# EAGLE design SipPuffDuoOutputsATtiny84MOSFET (EAGLE 9.1.3)
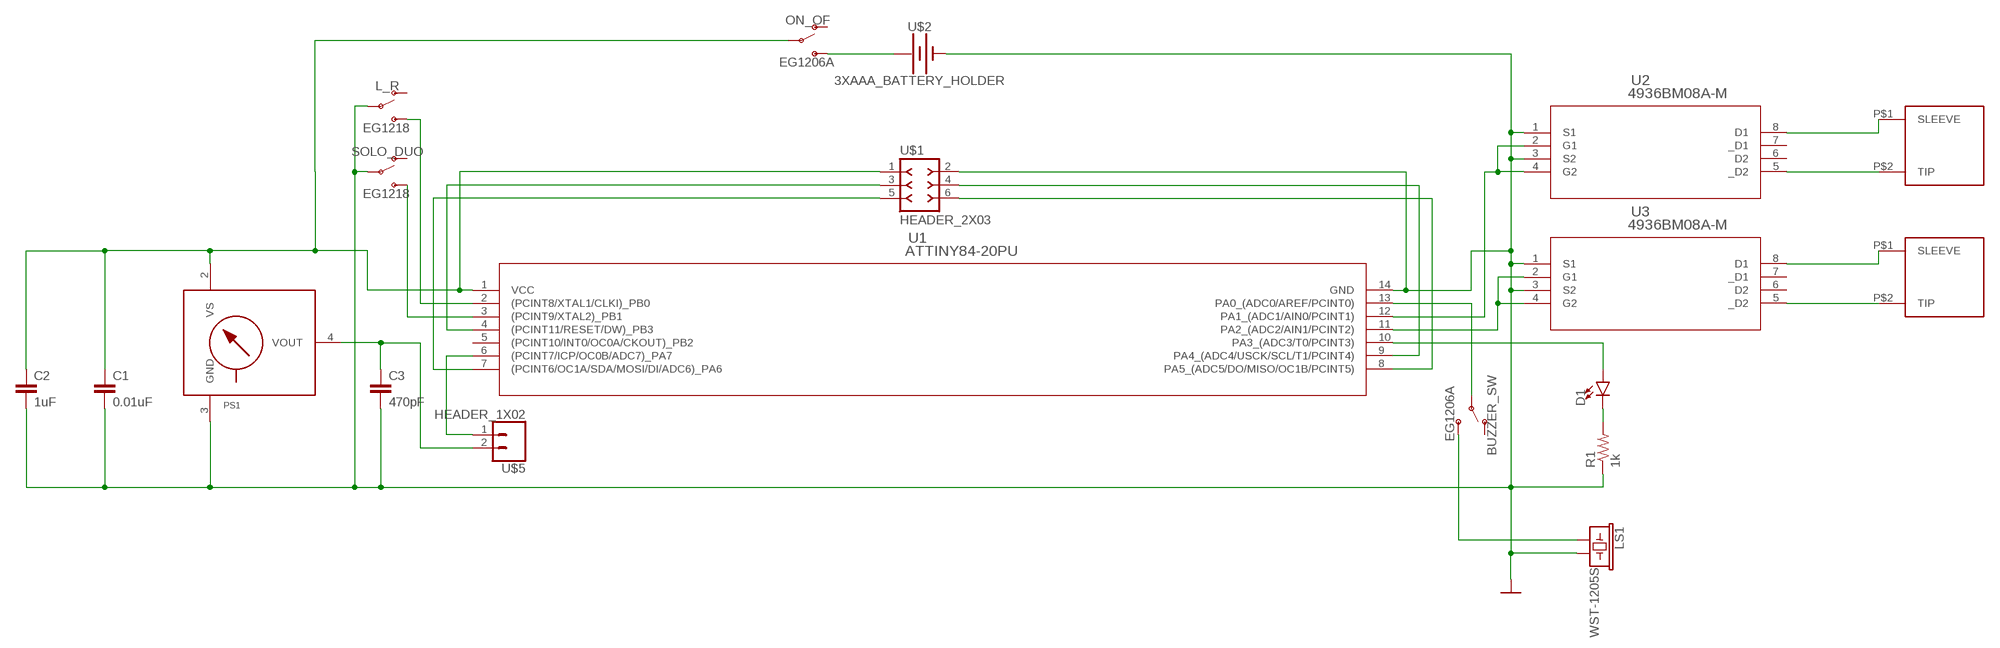
[diagram p0: schematic, sheet 1]

## Parts
BUZZER_SW  EG1206A  [EG1206A]
C1  0.01uF  0.1UF-KIT-EZ-50V-20%  [CAP-PTH-SMALL-KIT]
C2  1uF  0.1UF-KIT-EZ-50V-20%  [CAP-PTH-SMALL-KIT]
C3  470pF  0.1UF-KIT-EZ-50V-20%  [CAP-PTH-SMALL-KIT]
D1  LED5MM  [LED_5MM]
L_R  EG1218  [EG1218]
LS1  WST-1205S  BUZZER-PTH  [BUZZER-12MM]
ON_OF  EG1206A  [EG1206A]
PS1  MPX-1351  [1351]
R1  1k  RESISTOR_R-US_  [RESISTOR_0207/10]
SOLO_DUO  EG1218  [EG1218]
U1  ATTINY84-20PU  [14P3]
U2  4936BM08A-M  [M08A-M]
U3  4936BM08A-M  [M08A-M]
U$1  HEADER_2X03  [2X3]
U$2  3XAAA_BATTERY_HOLDER  [3XAAA_BATTERY_HOLDER]
U$3  MONO_WIRE  [MONO_WIRE]
U$4  MONO_WIRE  [MONO_WIRE]
U$5  HEADER_1X02  [1X02]

## Nets
5V: C1.1 C2.1 ON_OF.2(P) PS1.2(VS) U1.1(VCC) U$1.1
GND: C1.2 C2.2 C3.2 L_R.2(P) LS1.- PS1.3(GND) R1.1 SOLO_DUO.2(P) U1.14(GND) U2.1(S1) U2.3(S2) U3.1(S1) U3.3(S2) U$1.2 U$2.P$2(-)
MPXVOUT: C3.1 PS1.4(VOUT) U$5.2
N$1: D1.A U1.10(PA3_(ADC3/T0/PCINT3))
N$2: U1.12(PA1_(ADC1/AIN0/PCINT1)) U2.2(G1) U2.4(G2)
N$3: L_R.3(S) U1.2((PCINT8/XTAL1/CLKI)_PB0)
N$4: U1.11(PA2_(ADC2/AIN1/PCINT2)) U3.2(G1) U3.4(G2)
N$5: SOLO_DUO.3(S) U1.3((PCINT9/XTAL2)_PB1)
N$6: U1.8(PA5_(ADC5/DO/MISO/OC1B/PCINT5)) U$1.6
N$7: D1.K(C) R1.2
N$8: U1.4((PCINT11/RESET/DW)_PB3) U$1.3
N$9: U1.9(PA4_(ADC4/USCK/SCL/T1/PCINT4)) U$1.4
N$10: U1.7((PCINT6/OC1A/SDA/MOSI/DI/ADC6)_PA6) U$1.5
N$11: ON_OF.3(S) U$2.P$1(+)
N$12: BUZZER_SW.3(S) LS1.+
N$13: BUZZER_SW.2(P) U1.13(PA0_(ADC0/AREF/PCINT0))
N$14: U2.8(D1) U$3.P$1(SLEEVE)
N$15: U2.5(_D2) U$3.P$2(TIP)
N$16: U3.5(_D2) U$4.P$2(TIP)
N$17: U3.8(D1) U$4.P$1(SLEEVE)
N$18: U1.6((PCINT7/ICP/OC0B/ADC7)_PA7) U$5.1
Unconnected: BUZZER_SW.1(O) L_R.1(O) ON_OF.1(O) PS1.1(NC) PS1.5(NC) PS1.6(NC) SOLO_DUO.1(O) U1.5((PCINT10/INT0/OC0A/CKOUT)_PB2) U2.6(D2) U2.7(_D1) U3.6(D2) U3.7(_D1)

## Library data of the parts
BUZZER_SW ON_OF = MMC Eagle:EG1206A
C1-C3 = MMC Eagle:0.1UF: 0.1µF ceramic capacitors A capacitor is a passive two-terminal electrical component used to store electrical energy temporarily in an electric field.; PROD_ID: CAP-08370; VALUE: 0.1uF
D1 = MMC Eagle:LED: LED (Generic) Standard schematic elements and footprints for 5mm, 3mm, 1206, and 0603 sized LEDs. Generic LEDs with no color specified.
L_R SOLO_DUO = MMC Eagle:EG1218
LS1 = MMC Eagle:BUZZER: Buzzer Small round buzzers that operate around the audible 2kHz range. You can use these as speakers to create simple music or user interfaces. Variant Overview: PTH - Mini Speaker - PC Mount 12mm 2.048kHz <https://www.sparkfun.com/products/7950> PTH_KIT - Mini Speaker - PC Mount 12mm 2.048kHz <https://www.sparkfun.com/products/7950> KIT simplifies soldering by adding stop mask to one side of the pads. PTH_NO_SILK - Mini Speaker - PC Mount 12mm 2.048kHz <https://www.sparkfun.com/products/7950> No silkscreen indicator of buzzer outline. PTH_KIT_NO_SILK - Mini Speaker - PC Mount 12mm 2.048kHz <https://www.sparkfun.com/products/7950> KIT package w/o silkscreen SMD - Buzzer Audio Magnetic (CCV-084B16) SMD buzzer used on, e.g. the LilyPad Buzzer <https://www.sparkfun.com/products/8463> and RFID USB Reader <https://www.sparkfun.com/products/9963>. SMD_KIT - Buzzer Audio Magnetic (CCV-084B16) SMD Buzzer with elongated pins to make soldering easier. Used on the SparkFun Simon Says - Surface Mount Soldering Kit <https://www.sparkfun.com/products/10935>.; PROD_ID: COMP-08253; SF_SKU: COM-07950
PS1 = MMC Eagle:MPX*****: Generic MPX pressure sensor
R1 = MMC Eagle:RESISTOR_R-US_: RESISTOR, American symbol
U1 = MMC Eagle:ATTINY84-20PU; MANUFACTURER_PART_NUMBER: ATTINY8420PU; VENDOR: Atmel
U2 U3 = MMC Eagle:4936B; MANUFACTURER_PART_NUMBER: LM34DM; VENDOR: Texas Instruments
U$1 = MMC Eagle:HEADER_2X03
U$2 = MMC Eagle:3XAAA_BATTERY_HOLDER
U$3 U$4 = MMC Eagle:MONO_WIRE
U$5 = MMC Eagle:HEADER_1X02

## Board
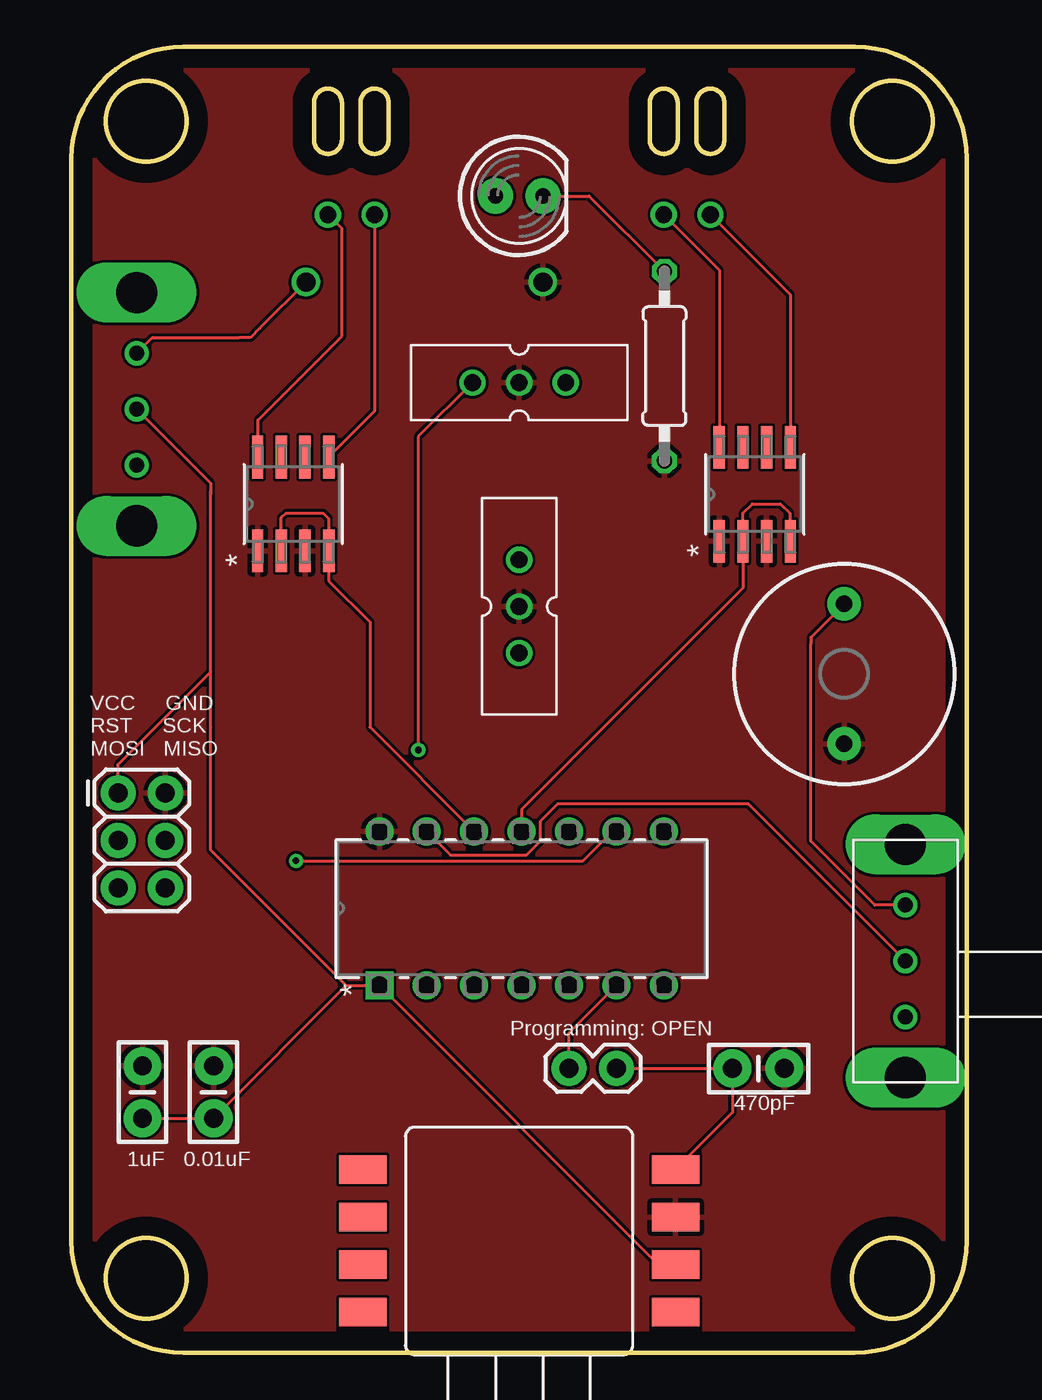
[diagram p1: board, top side]
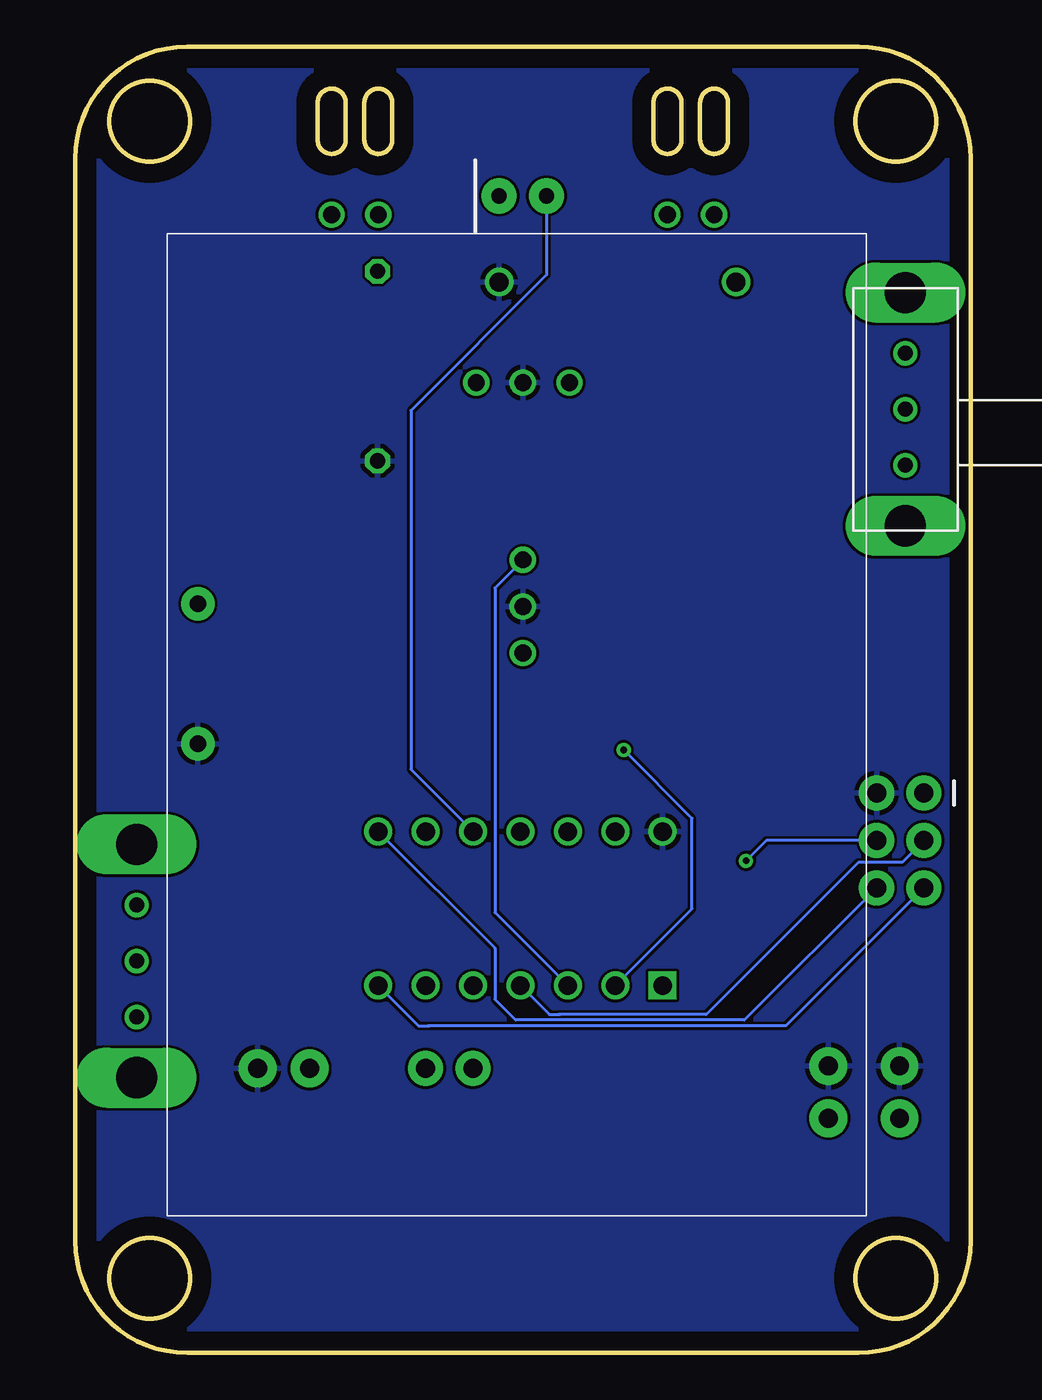
[diagram p2: board, bottom side, seen from below]

Size 48 x 70 mm. Coordinates in mm from the lower left corner, seen from the top.
Outline: 35,67 arc180 33.5,67
Outline: 33.5,67 33.5,65
Outline: 33.5,65 arc180 35,65
Outline: 35,65 35,67
Outline: 31,65 arc180 32.5,65
Outline: 31,67 31,65
Outline: 32.5,67 arc180 31,67
Outline: 32.5,65 32.5,67
Outline: 17,67 arc180 15.5,67
Outline: 15.5,67 15.5,65
Outline: 15.5,65 arc180 17,65
Outline: 17,65 17,67
Outline: 13,65 arc180 14.5,65
Outline: 13,67 13,65
Outline: 14.5,67 arc180 13,67
Outline: 14.5,65 14.5,67
Outline: 13,65 13,67
Outline: 13,67 arc-180 14.5,67
Outline: 14.5,67 14.5,65
Outline: 14.5,65 arc-180 13,65
Outline: 15.5,67 15.5,65
Outline: 15.5,65 arc180 17,65
Outline: 17,65 17,67
Outline: 17,67 arc180 15.5,67
Outline: 31,65 31,67
Outline: 31,67 arc-180 32.5,67
Outline: 32.5,67 32.5,65
Outline: 32.5,65 arc-180 31,65
Outline: 33.5,67 33.5,65
Outline: 33.5,65 arc180 35,65
Outline: 35,65 35,67
Outline: 35,67 arc180 33.5,67
Outline: 42,70 6,70 arc90 0,64 0,6 arc90 6,0 42,0 arc90 48,6 48,64 arc90 42,70
Outline: circle at 4,66 radius 2.15
Outline: circle at 44,66 radius 2.15
Outline: circle at 4,4 radius 2.15
Outline: circle at 44,4 radius 2.15
Copper layers (1*16): Top 0.035mm / dielectric 1.5mm / Bottom 0.035mm
Design rules "default": minimum track width 6mil, minimum drill 0.35mm, track to track 6mil, track to pad 6mil, pad to pad 6mil, via to via 6mil, smd to smd 6mil, copper to edge 40mil, drill to drill 6mil, minimum pad ring 10mil, minimum via ring 8mil, stop-mask expansion 4mil, vias tented up to drill 0mil, thermal gap 10mil

### Footprints (pad centres in the part's own frame; a part is rotated, then mirrored left to right if it is on the bottom)
EG1206A = drill 0.8: 1 3.5,2.8; 2 6.5,2.8; 3 9.5,2.8 | drill 2.2 pad 2.54 long: MT1 0.25,2.8; MT2 12.75,2.8
CAP-PTH-SMALL-KIT = drill 1.016 pad 2.032: 1 -1.397,0; 2 1.397,0
LED_5MM = drill 0.813 pad 1.88: A -1.27,0; K 1.27,0
EG1218 = drill 0.9: 1 -2.5,0; 2 0,0; 3 2.5,0
BUZZER-12MM = drill 0.9 pad 1.778: + 3.75,0; - -3.75,0
1351 = smd 2.54 x 1.524: 1 8.382,-3.81; 2 8.382,-1.27; 3 8.382,1.27; 4 8.382,3.81; 5 -8.382,3.81; 6 -8.382,1.27; 7 -8.382,-1.27; 8 -8.382,-3.81
RESISTOR_0207/10 = drill 0.813 octagon: 1 -5.08,0; 2 5.08,0
14P3 = drill 0.991 pad 1.499 square: 1 -8.255,15.24 | drill 0.991 pad 1.499: 2 -8.255,12.7; 3 -8.255,10.16; 4 -8.255,7.62; 5 -8.255,5.08; 6 -8.255,2.54; 7 -8.255,0; 8 0,0; 9 0,2.54; 10 0,5.08; 11 0,7.62; 12 0,10.16; 13 0,12.7; 14 0,15.24
M08A-M = smd 2.286 x 0.61: 1 -2.515,1.905; 2 -2.515,0.635; 3 -2.515,-0.635; 4 -2.515,-1.905; 5 2.515,-1.905; 6 2.515,-0.635; 7 2.515,0.635; 8 2.515,1.905
2X3 = drill 1.016 pad 1.88: 1 0,0; 2 0,2.54; 3 2.54,0; 4 2.54,2.54; 5 5.08,0; 6 5.08,2.54
3XAAA_BATTERY_HOLDER = drill 1.02: P$1 50.035,6.995; P$2 50.035,19.695
MONO_WIRE = drill 0.9: P$1 -1.25,0; P$2 1.25,0
1X02 = drill 1.016 pad 1.88: 1 0,0; 2 2.54,0

### Placement (x,y rotation side)
BUZZER_SW  47.5,14.5 90 top
C1  7.62,13.97 90 top
C2  3.81,13.97 90 top
C3  36.83,15.24 0 top
D1  24,62 0 top
L_R  24,52 180 top
LS1  41.42,36.39 90 top
ON_OF  0.7,44.07 90 bottom
PS1  24,6 0 top
R1  31.79,52.88 90 top
SOLO_DUO  24,40 90 top
U1  31.75,27.94 90 top
U2  11.89,45.49 90 top
U3  36.63,46.01 90 top
U$1  2.5,30 270 top
U$2  5.58,7.35 90 bottom
U$3  15,61 0 top
U$4  33,61 0 top
U$5  26.68,15.25 0 top

### Tracks (layer width: path | path; a pad name or v marks a point on that pad's centre or on a via)
5V
  Top 0.152: 7.47,35 7.47,33.53 7.47,26.95 14.73,19.68 | 7.47,35 7.47,36.5 | 7.47,36.5 7.47,46 | 7.47,46 7.47,46.18 | ON_OF.2 7.47,46.6 7.47,46 | C2.1 C1.1 14.73,19.68 | 14.73,19.68 U1.1 31.46,4.73 PS1.2 | 7.47,34.97 7.47,35 | U$1.1 2.5,31.53 7.47,36.5
GND
  pour Bottom: -1.17,70.93 49.85,70.93 49.85,-1.12 -1.17,-1.12
  pour Top: -1.25,71.16 48.82,71.16 48.82,-1.04 -1.25,-1.04
MPXVOUT
  Top 0.152: PS1.4 32.46,9.91 35.43,12.88 C3.1 U$5.2
N$1
  Bottom 0.152: D1.A 22.73,57.77 30,50.5 30,31.27 U1.10
N$2
  Top 0.152: U1.12 16,33.53 16,39.17 13.79,41.37 U2.4 13.79,44.7 13.5,45 11.5,45 11.26,44.76 U2.2
N$3  (via drill 0.35)
  Top 0.152: L_R.3 18.59,49.09 v18.59,32.31
  Bottom 0.152: v18.59,32.31 14.94,28.65 14.94,23.8 U1.2
N$4
  Top 0.152: 35.97,43.43 U3.2 | 38.56,43.43 U3.4 | U3.4 38.53,43 38.53,42.65 | U3.2 36,45 36.5,45.5 38,45.5 38.5,45 38.5,43.53 U3.4 | U3.2 35.99,40.99 24.13,29.13 U1.11
N$5
  Bottom 0.152: SOLO_DUO.3 25.5,41 25.5,23.59 U1.3
N$6
  Bottom 0.152: U1.8 25.5,21.69 25.5,18.95 24.38,17.83 12.13,17.83 U$1.6
N$7
  Top 0.152: D1.K 27.75,62 R1.2
N$8
  Bottom 0.152: 22,18.14 14.17,18.14 6.02,26.29 3.67,26.29 U$1.3 | 22,18.14 22.1,18.14 | U1.4 22.58,18.14 22,18.14
N$9  (via drill 0.35)
  Top 0.152: v12.04,26.36 27.43,26.36 28.65,27.58 28.8,27.58 29.11,27.89 U1.9
  Bottom 0.152: U$1.4 10.95,27.46 v12.04,26.36
N$10
  Bottom 0.152: 29,17.53 10,17.53 9.89,17.53 U$1.5 | 29,17.53 29.11,17.53 | U1.7 29.59,17.53 29,17.53
N$11
  Top 0.152: 9.3,54.41 9,54.41 | U$2.P$1 10.1,54.91 9.6,54.41 9,54.41 | ON_OF.3 4.34,54.41 9,54.41
N$12
  Top 0.152: 39.62,38.1 39.62,38 | 39.62,38 39.62,27.43 43.06,24 BUZZER_SW.3 | LS1.+ 39.62,38.34 39.62,38
N$13
  Top 0.152: BUZZER_SW.2 36.29,29.41 26.06,29.41 25.15,28.5 25.15,27.43 24.38,26.67 20.32,26.67 U1.13
N$14
  Top 0.152: U2.8 10,48.02 10,50 14.5,54.5 14.5,60.25 U$3.P$1
N$15
  Top 0.152: U$3.P$2 16.25,50.46 U2.5
N$16
  Top 0.152: U$4.P$2 38.53,56.72 U3.5
N$17
  Top 0.152: U$4.P$1 34.73,58.02 U3.8
N$18
  Top 0.152: U$5.1 26.68,17.16 U1.6

### Text on the board
tPlace: VCC GND / RST SCK / MOSI MISO | Programming: OPEN | 470pF | 1uF | 0.01uF